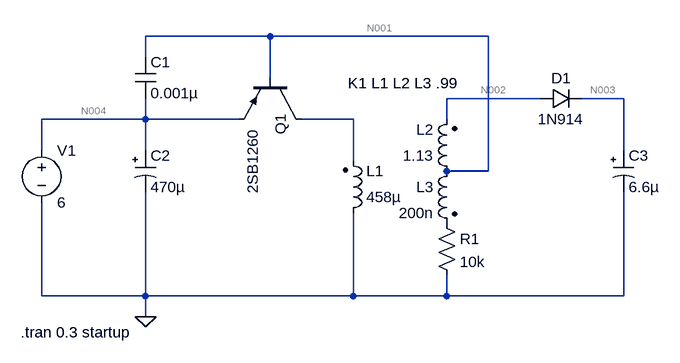
[diagram p0: schematic conventer dc-dc.asc]
conventer dc-dc.asc, the LTspice schematic file:
Version 4
SHEET 1 896 680
WIRE 0 -64 -192 -64
WIRE 336 -64 0 -64
WIRE -192 -32 -192 -64
WIRE 0 0 0 -64
WIRE 416 32 272 32
WIRE 544 32 480 32
WIRE -192 64 -192 32
WIRE -192 64 -352 64
WIRE -48 64 -192 64
WIRE 128 64 48 64
WIRE 272 64 272 32
WIRE -352 112 -352 64
WIRE -192 112 -192 64
WIRE 544 112 544 32
WIRE 128 128 128 64
WIRE 336 144 336 -64
WIRE 336 144 272 144
WIRE -352 336 -352 192
WIRE -192 336 -192 176
WIRE -192 336 -352 336
WIRE 128 336 128 208
WIRE 128 336 -192 336
WIRE 272 336 272 304
WIRE 272 336 128 336
WIRE 544 336 544 176
WIRE 544 336 272 336
WIRE -192 368 -192 336
FLAG -192 368 0
SYMBOL ind2 112 224 M180
WINDOW 0 36 80 Left 2
WINDOW 3 36 40 Left 2
SYMATTR InstName L1
SYMATTR Value 458µ
SYMATTR Type ind
SYMBOL ind2 288 160 R180
WINDOW 0 36 80 Left 2
WINDOW 3 36 40 Left 2
SYMATTR InstName L2
SYMATTR Value 1.13
SYMATTR Type ind
SYMBOL ind2 288 128 M0
SYMATTR InstName L3
SYMATTR Value 200n
SYMATTR Type ind
SYMBOL pnp 48 0 R90
WINDOW 3 80 75 Left 2
SYMATTR Value 2SB1260
SYMATTR InstName Q1
SYMBOL cap -208 -32 R0
SYMATTR InstName C1
SYMATTR Value 0.001µ
SYMBOL polcap -208 112 R0
WINDOW 3 24 56 Left 2
SYMATTR Value 470µ
SYMATTR InstName C2
SYMATTR Description Capacitor
SYMATTR Type cap
SYMATTR SpiceLine V=10 Irms=3.87298 Rser=0.015 Lser=0
SYMBOL res 256 208 R0
SYMATTR InstName R1
SYMATTR Value 10k
SYMBOL voltage -352 96 R0
WINDOW 123 0 0 Left 0
SYMATTR SpiceLine Rser=10m Cpar=10u
SYMATTR InstName V1
SYMATTR Value 6
SYMBOL diode 416 48 R270
WINDOW 0 32 32 VTop 2
WINDOW 3 0 32 VBottom 2
SYMATTR InstName D1
SYMATTR Value 1N914
SYMBOL polcap 528 112 R0
WINDOW 3 24 56 Left 2
SYMATTR Value 6.6µ
SYMATTR InstName C3
SYMATTR Description Capacitor
SYMATTR Type cap
TEXT -384 392 Left 2 !.tran 0.3 startup
TEXT 120 8 Left 2 !K1 L1 L2 L3 .99

The netlist it stands for:
* conventer dc-dc.asc
L1 0 N005 458µ
L2 N001 N002 1.13
L3 N001 P001 200n
Q1 N005 N001 N004 0 2SB1260
C1 N001 N004 0.001µ
C2 N004 0 470µ V=10 Irms=3.87298 Rser=0.015 Lser=0
R1 P001 0 10k
V1 N004 0 6 Rser=10m Cpar=10u
D1 N002 N003 1N914
C3 N003 0 6.6µ
.model D D
.lib standard.dio
.model NPN NPN
.model PNP PNP
.lib standard.bjt
.tran 0.3 startup
K1 L1 L2 L3 .99
.backanno
.end

* Results of the author's LTspice run, read from the files saved beside the schematic
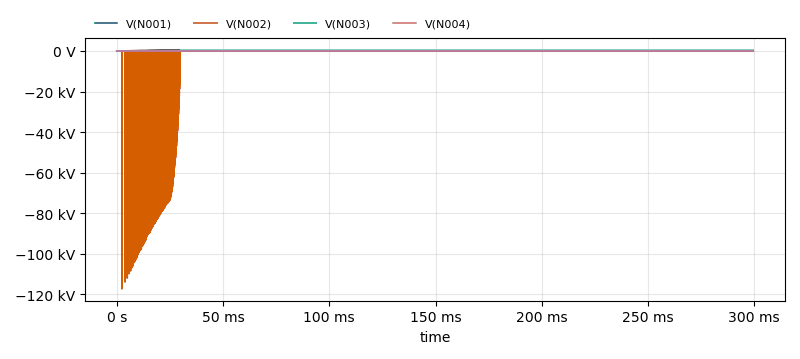
[diagram p1: Transient Analysis of conventer dc-dc.asc, plotted from the saved traces]
* Transient Analysis, 1 run:
*   V(N001): min 0 V, max 6.597 V, average 5.272 V, rms 5.274 V, last 5.308 V
*   V(N002): min -117.4 kV, max 289.1 V, average 5.281 V, rms 971.7 V, last 5.308 V
*   V(N003): min 0 V, max 288.4 V, average 276.8 V, rms 280.4 V, last 288.4 V
*   V(N004): min 0 V, max 5.999 V, average 5.996 V, rms 5.996 V, last 5.999 V